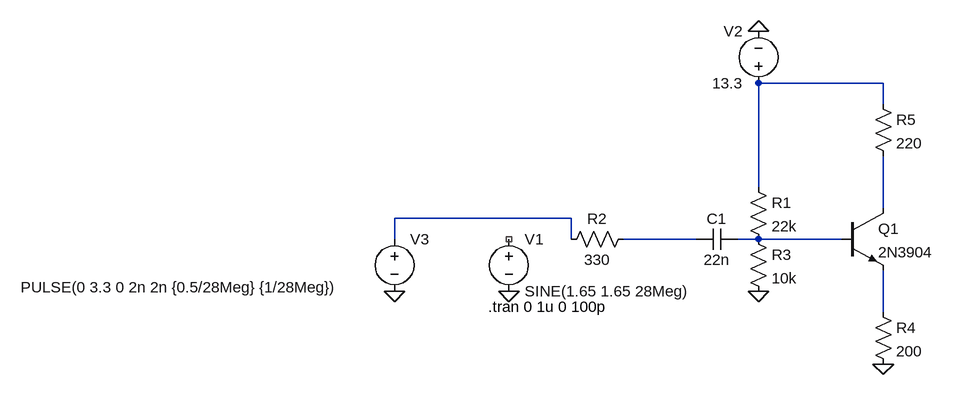
[diagram p0: schematic Draft6.asc]
Draft6.asc, the LTspice schematic file:
Version 4
SHEET 1 880 680
WIRE 560 -64 368 -64
WIRE 560 -32 560 -64
WIRE 368 96 368 -64
WIRE 560 128 560 48
WIRE 80 144 -192 144
WIRE -192 176 -192 144
WIRE 80 176 80 144
WIRE 272 176 160 176
WIRE 368 176 336 176
WIRE 496 176 368 176
WIRE 560 288 560 224
FLAG -16 256 0
FLAG 368 256 0
FLAG 368 -144 0
FLAG 560 368 0
FLAG -192 256 0
SYMBOL voltage -16 160 R0
WINDOW 123 0 0 Left 0
WINDOW 39 0 0 Left 0
SYMATTR InstName V1
SYMATTR Value SINE(1.65 1.65 28Meg)
SYMBOL res 352 80 R0
SYMATTR InstName R1
SYMATTR Value 22k
SYMBOL cap 336 160 R90
WINDOW 0 0 32 VBottom 2
WINDOW 3 32 32 VTop 2
SYMATTR InstName C1
SYMATTR Value 22n
SYMBOL res 176 160 R90
WINDOW 0 0 56 VBottom 2
WINDOW 3 32 56 VTop 2
SYMATTR InstName R2
SYMATTR Value 330
SYMBOL res 352 160 R0
SYMATTR InstName R3
SYMATTR Value 10k
SYMBOL voltage 368 -48 R180
WINDOW 0 24 96 Left 2
WINDOW 3 24 16 Left 2
WINDOW 123 0 0 Left 0
WINDOW 39 0 0 Left 0
SYMATTR InstName V2
SYMATTR Value 13.3
SYMBOL npn 496 128 R0
SYMATTR InstName Q1
SYMATTR Value 2N3904
SYMBOL res 544 272 R0
SYMATTR InstName R4
SYMATTR Value 200
SYMBOL res 544 -48 R0
SYMATTR InstName R5
SYMATTR Value 220
SYMBOL voltage -192 160 R0
WINDOW 3 -575 90 Left 2
WINDOW 123 0 0 Left 0
WINDOW 39 0 0 Left 0
SYMATTR InstName V3
SYMATTR Value PULSE(0 3.3 0 2n 2n {0.5/28Meg} {1/28Meg})
TEXT -48 280 Left 2 !.tran 0 1u 0 100p

The netlist it stands for:
* Draft6.asc
V1 NC_01 0 SINE(1.65 1.65 28Meg)
R1 N001 N005 22k
C1 N005 N004 22n
R2 N004 N003 330
R3 N005 0 10k
V2 N001 0 13.3
Q1 N002 N005 N006 0 2N3904
R4 N006 0 200
R5 N001 N002 220
V3 N003 0 PULSE(0 3.3 0 2n 2n {0.5/28Meg} {1/28Meg})
.model NPN NPN
.model PNP PNP
.lib standard.bjt
.tran 0 1u 0 100p
.backanno
.end